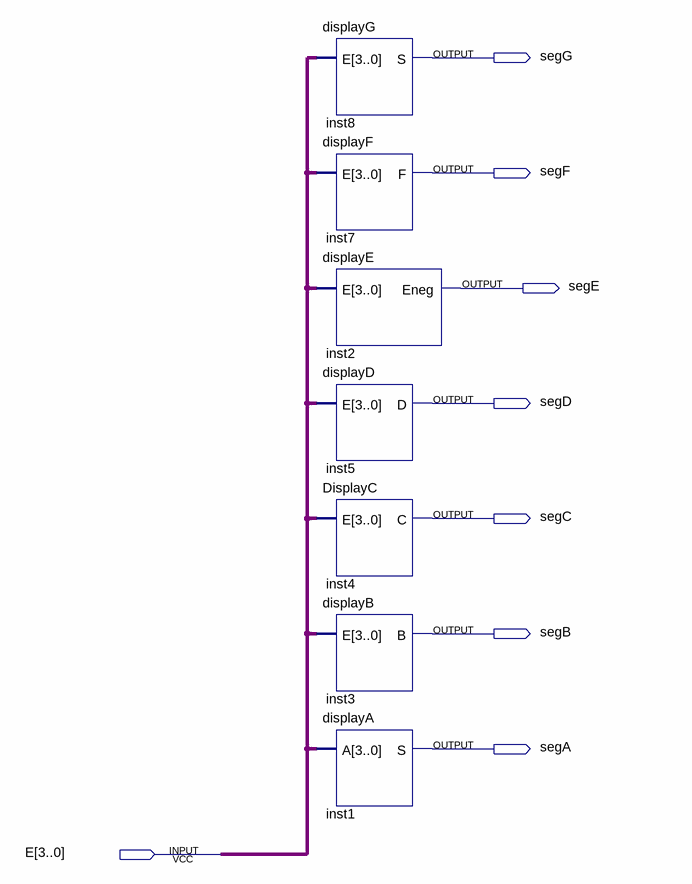
[diagram p0: schematic sheet]
// Quartus schematic display4b.bdf as structural Verilog: 7 symbols, 8 pins
module display4b (
  input  [3:0] E,
  output segG,
  output segF,
  output segE,
  output segD,
  output segC,
  output segB,
  output segA
);

  displayG inst8 (.E(E), .S(segG));
  displayF inst7 (.E(E), .F(segF));
  displayE inst2 (.E(E), .Eneg(segE));
  displayD inst5 (.E(E), .D(segD));
  DisplayC inst4 (.E(E), .C(segC));
  displayB inst3 (.E(E), .B(segB));
  displayA inst1 (.A(E), .S(segA));
endmodule
